# EAGLE schematic ESP8266 MegaD v0.9 (EAGLE 7.5.0)
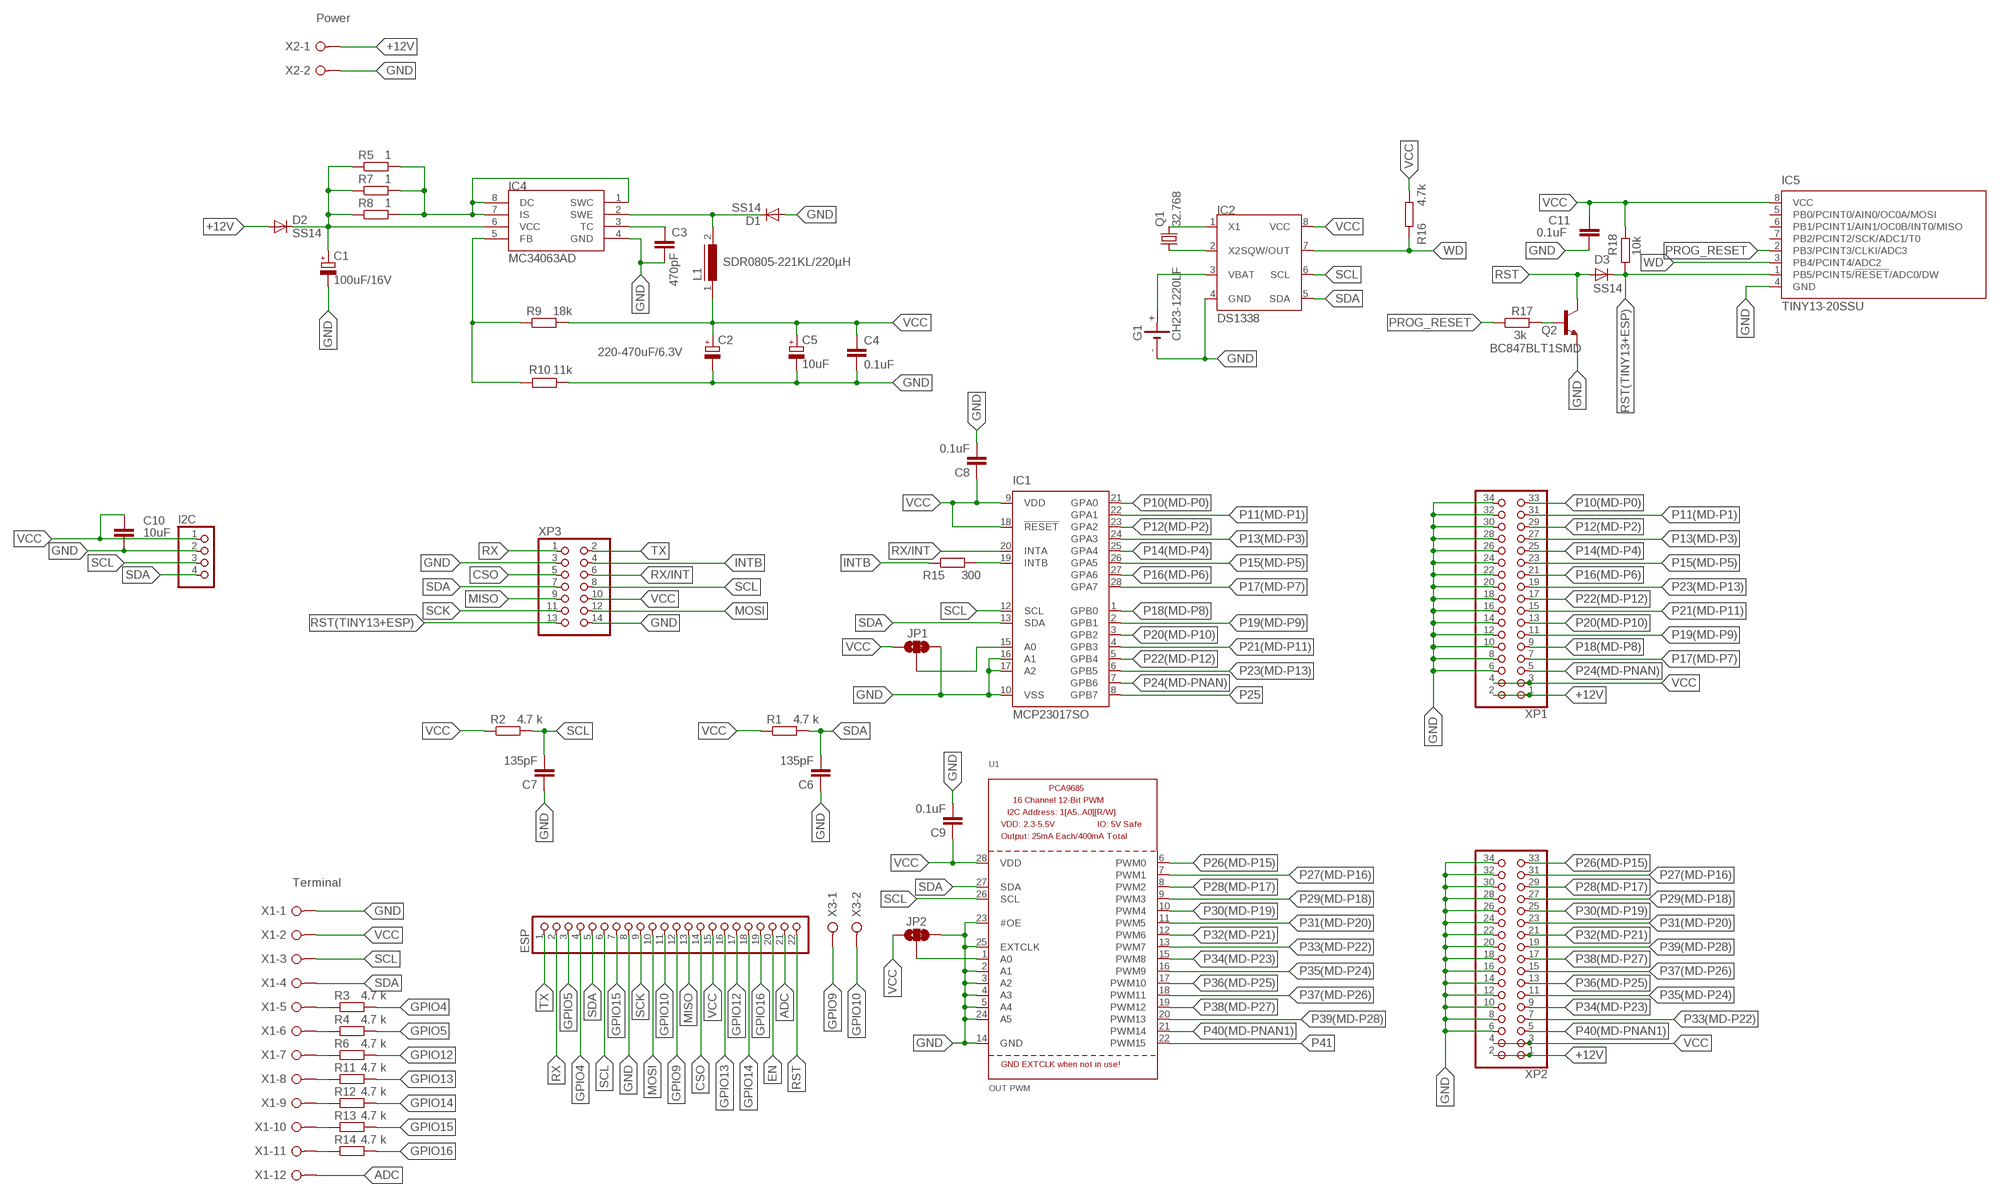
[diagram p0: schematic, sheet 1]

## Parts
C1  100uF/16V  CPOL-EU140CLH-0810  [140CLH-0810]
C2  220-470uF/6.3V  CPOL-EU140CLH-0810  [140CLH-0810]
C3  470pF  C-EUC1206  [C1206]
C4  0.1uF  C-EUC1206  [C1206]
C5  10uF  CPOL-EUC/6032-28R  [C/6032-28R]
C6  135pF  C-EUC1206  [C1206]
C7  135pF  C-EUC1206  [C1206]
C8  0.1uF  C-EUC1206  [C1206]
C9  0.1uF  C-EUC1206  [C1206]
C10  10uF  C-EUC1206  [C1206]
C11  0.1uF  C-EUC1206  [C1206]
D1  SS14  S1M  [SMA]
D2  SS14  S1M  [SMA]
D3  SS14  S1M  [SMA]
ESP  PINHD-1X22  [1X22]
G1  CH23-1220LF  [CH23-1220LF]
I2C  PINHD-1X4  [1X04]
IC1  MCP23017SO  [SO28W]
IC2  DS1338  DS1307  [SOIC-8]
IC4  MC34063AD  [SOIC8]
IC5  TINY13-20SSU  [8S1]
JP1  JUMPER-PAD-3-2OF3_NC_BY_TRACE_LARGE  [PAD-JUMPER-3-2OF3_NC_BY_TRACE_YES_SILK_LARGE]
JP2  JUMPER-PAD-3-2OF3_NC_BY_TRACE_LARGE  [PAD-JUMPER-3-2OF3_NC_BY_TRACE_YES_SILK_LARGE]
L1  SDR0805-221KL/220µH  DR73  [DR73]
Q1  32.768  CRYSTALTC38H  [TC38H]
Q2  BC847BLT1SMD  [SOT23]
R1  4.7 k  R-EU_R1206  [R1206]
R2  4.7 k  R-EU_R1206  [R1206]
R3  4.7 k  R-EU_R1206  [R1206]
R4  4.7 k  R-EU_R1206  [R1206]
R5  1  R-EU_R1206  [R1206]
R6  4.7 k  R-EU_R1206  [R1206]
R7  1  R-EU_R1206  [R1206]
R8  1  R-EU_R1206  [R1206]
R9  18k  R-EU_R1206  [R1206]
R10  11k  R-EU_R1206  [R1206]
R11  4.7 k  R-EU_R1206  [R1206]
R12  4.7 k  R-EU_R1206  [R1206]
R13  4.7 k  R-EU_R1206  [R1206]
R14  4.7 k  R-EU_R1206  [R1206]
R15  300  R-EU_R1206  [R1206]
R16  4.7k  R-EU_R1206  [R1206]
R17  3k  R-EU_R1206  [R1206]
R18  10k  R-EU_R1206  [R1206]
U1  OUT PWM  PCA9685  [TSSOP28]
X1  Terminal  W237-12P  [W237-12P]
X2  Power  W237-02P  [W237-132]
X3  W237-02P  [W237-132]
XP1  PINHD-2X17/90  [2X17/90]
XP2  PINHD-2X17  [2X17]
XP3  PINHD-2X7  [2X07]

## Nets
+12V: D2.A X2.1 XP1.1 XP1.2 XP2.1 XP2.2
ADC: ESP.21 X1.12
CSO: ESP.14 XP3.5
EN: ESP.20
GND: C1.- C2.- C3.2 C4.2 C5.- C6.1 C7.1 C8.2 C9.2 C10.1 C11.2 D1.A ESP.8 G1.- I2C.2 IC1.10(VSS) IC1.16(A1) IC1.17(A2) IC2.4(GND) IC4.4(GND) IC5.4(GND) JP1.3 JP2.3 Q2.2(E) R10.1 U1.2(A1) U1.3(A2) U1.4(A3) U1.5(A4) U1.14(GND) U1.23(#OE) U1.24(A5) U1.25(EXTCLK) X1.1 X2.2 XP1.6 XP1.8 XP1.10 XP1.12 XP1.14 XP1.16 XP1.18 XP1.20 XP1.22 XP1.24 XP1.26 XP1.28 XP1.30 XP1.32 XP1.34 XP2.6 XP2.8 XP2.10 XP2.12 XP2.14 XP2.16 XP2.18 XP2.20 XP2.22 XP2.24 XP2.26 XP2.28 XP2.30 XP2.32 XP2.34 XP3.3 XP3.14
GPIO4: ESP.4 R3.2
GPIO5: ESP.3 R4.2
GPIO9: ESP.12 X3.1
GPIO10: ESP.11 X3.2
GPIO12: ESP.17 R6.2
GPIO13: ESP.16 R11.2
GPIO14: ESP.18 R12.2
GPIO15: ESP.7 R13.2
GPIO16: ESP.19 R14.2
INTB: R15.1 XP3.4
MISO: ESP.13 XP3.9
MOSI: ESP.10 XP3.12
N$1: IC1.19(INTB) R15.2
N$2: R3.1 X1.5
N$3: IC4.1(SWC) IC4.7(IS) IC4.8(DC) R5.2 R7.2 R8.2
N$4: C3.1 IC4.3(TC)
N$5: D1.C IC4.2(SWE) L1.2
N$6: IC4.5(FB) R9.1 R10.2
N$7: C1.+ D2.C IC4.6(VCC) R5.1 R7.1 R8.1
N$8: R4.1 X1.6
N$9: R6.1 X1.7
N$10: R11.1 X1.8
N$11: R12.1 X1.9
N$12: R13.1 X1.10
N$13: R14.1 X1.11
N$14: IC2.1(X1) Q1.2
N$15: IC2.2(X2) Q1.1
N$16: G1.+ IC2.3(VBAT)
N$17: Q2.1(B) R17.2
N$18: IC1.15(A0) JP1.2
N$19: JP2.2 U1.1(A0)
P10(MD-P0): IC1.21(GPA0) XP1.33
P11(MD-P1): IC1.22(GPA1) XP1.31
P12(MD-P2): IC1.23(GPA2) XP1.29
P13(MD-P3): IC1.24(GPA3) XP1.27
P14(MD-P4): IC1.25(GPA4) XP1.25
P15(MD-P5): IC1.26(GPA5) XP1.23
P16(MD-P6): IC1.27(GPA6) XP1.21
P17(MD-P7): IC1.28(GPA7) XP1.7
P18(MD-P8): IC1.1(GPB0) XP1.9
P19(MD-P9): IC1.2(GPB1) XP1.11
P20(MD-P10): IC1.3(GPB2) XP1.13
P21(MD-P11): IC1.4(GPB3) XP1.15
P22(MD-P12): IC1.5(GPB4) XP1.17
P23(MD-P13): IC1.6(GPB5) XP1.19
P24(MD-PNAN): IC1.7(GPB6) XP1.5
P25: IC1.8(GPB7)
P26(MD-P15): U1.6(PWM0) XP2.33
P27(MD-P16): U1.7(PWM1) XP2.31
P28(MD-P17): U1.8(PWM2) XP2.29
P29(MD-P18): U1.9(PWM3) XP2.27
P30(MD-P19): U1.10(PWM4) XP2.25
P31(MD-P20): U1.11(PWM5) XP2.23
P32(MD-P21): U1.12(PWM6) XP2.21
P33(MD-P22): U1.13(PWM7) XP2.7
P34(MD-P23): U1.15(PWM8) XP2.9
P35(MD-P24): U1.16(PWM9) XP2.11
P36(MD-P25): U1.17(PWM10) XP2.13
P37(MD-P26): U1.18(PWM11) XP2.15
P38(MD-P27): U1.19(PWM12) XP2.17
P39(MD-P28): U1.20(PWM13) XP2.19
P40(MD-PNAN1): U1.21(PWM14) XP2.5
P41: U1.22(PWM15)
PROG_RESET: IC5.2(PB3/PCINT3/CLKI/ADC3) R17.1
RST: D3.A ESP.22 Q2.3(C)
RST(TINY13+ESP): D3.C IC5.1(PB5/PCINT5/!RESET!/ADC0/DW) R18.1 XP3.13
RX: ESP.2 XP3.1
RX/INT: IC1.20(INTA) XP3.6
SCK: ESP.9 XP3.11
SCL: C7.2 ESP.6 I2C.3 IC1.12(SCL) IC2.6(SCL) R2.2 U1.26(SCL) X1.3 XP3.8
SDA: C6.2 ESP.5 I2C.4 IC1.13(SDA) IC2.5(SDA) R1.2 U1.27(SDA) X1.4 XP3.7
TX: ESP.1 XP3.2
VCC: C2.+ C4.1 C5.+ C8.1 C9.1 C10.2 C11.1 ESP.15 I2C.1 IC1.9(VDD) IC1.18(!RESET) IC2.8(VCC) IC5.8(VCC) JP1.1 JP2.1 L1.1 R1.1 R2.1 R9.2 R16.2 R18.2 U1.28(VDD) X1.2 XP1.3 XP1.4 XP2.3 XP2.4 XP3.10
WD: IC2.7(SQW/OUT) IC5.3(PB4/PCINT4/ADC2) R16.1
Unconnected: IC5.5(PB0/PCINT0/AIN0/OC0A/MOSI) IC5.6(PB1/PCINT1/AIN1/OC0B/INT0/MISO) IC5.7(PB2/PCINT2/SCK/ADC1/T0)

## Library data of the parts
C1 C2 C5 = rcl:CPOL-EU: POLARIZED CAPACITOR, European symbol
C3 C4 C6-C11 = rcl:C-EU: CAPACITOR, European symbol
D1-D3 = diode:S1M
ESP = pinhead:PINHD-1X22: PIN HEADER
G1 = battery:CH23-1220LF: Battary Holder, DIP, 12mm multicomp PART NO. CH-1220LF Source: Data sheet <http://www.farnell.com/datasheets/1505861.pdf>
I2C = pinhead:PINHD-1X4: PIN HEADER
IC1 = microchip:MCP23017: http://ww1.microchip.com/downloads/en/DeviceDoc/21952a.pdf Source: http://ww1.microchip.com/downloads/en/DeviceDoc/21952a.pdf; MF: MICROCHIP; MPN: MCP23017-E/SO; OC_FARNELL: 1332087; OC_NEWARK: 31K2958
IC2 = dallas-1:DS1307: I2C Serial RTC w/56 bytes battery backed RAM
IC4 = mc34063:MC34063
IC5 = atmel:TINY13: 8-bit AVR Microcontroller with 1K Bytes In-System Programmable Flash Source: http://www.atmel.com/dyn/resources/prod_documents/2535S.pdf; MPN: ATTINY13-20SSU; OC_FARNELL: 1455133; OC_NEWARK: 58M3771
JP1 JP2 = SparkFun-Passives:JUMPER-PAD-3-2OF3_NC_BY_TRACE
L1 = inductors:DR73: High Power Density, High Efficiency, Shielded Inductors Source: coiltronics_dr_series.pdf
Q1 = crystal:CRYSTAL: CRYSTAL; OC_FARNELL: unknown; OC_NEWARK: unknown
Q2 = transistor-npn:BC847*: NPN Transistor
R1-R18 = rcl:R-EU_: RESISTOR, European symbol
U1 = adafruit:PCA9685: PCA9685 - 16 Channel 12-Bit I2C PWM Controller 5.0V tolerant 16 channel, 12-bit I2C PWM controller with 25mA per output (max. 400mA total) Digikey: 568-5931-1-ND
X1 = con-wago-508:W237-12P: WAGO SREW CLAMP; OC_FARNELL: unknown; OC_NEWARK: unknown
X2 X3 = con-wago-508:W237-02P: WAGO SREW CLAMP; OC_FARNELL: unknown; OC_NEWARK: unknown
XP1 XP2 = pinhead:PINHD-2X17: PIN HEADER
XP3 = pinhead:PINHD-2X7: PIN HEADER